# EasyEDA Pro project ProPrj_桌面数控电源New_2025-02-12.epro, schematic Schematic2
Board Name: FPC控制板; Create Date: 2025-02-01; Page Name: P1; Project Name: 桌面数控电源New; Schematic Name: Schematic2; Update Date: 2025-02-04; Company: 嘉立创EDA; Page Size: A4; Version: V1.0
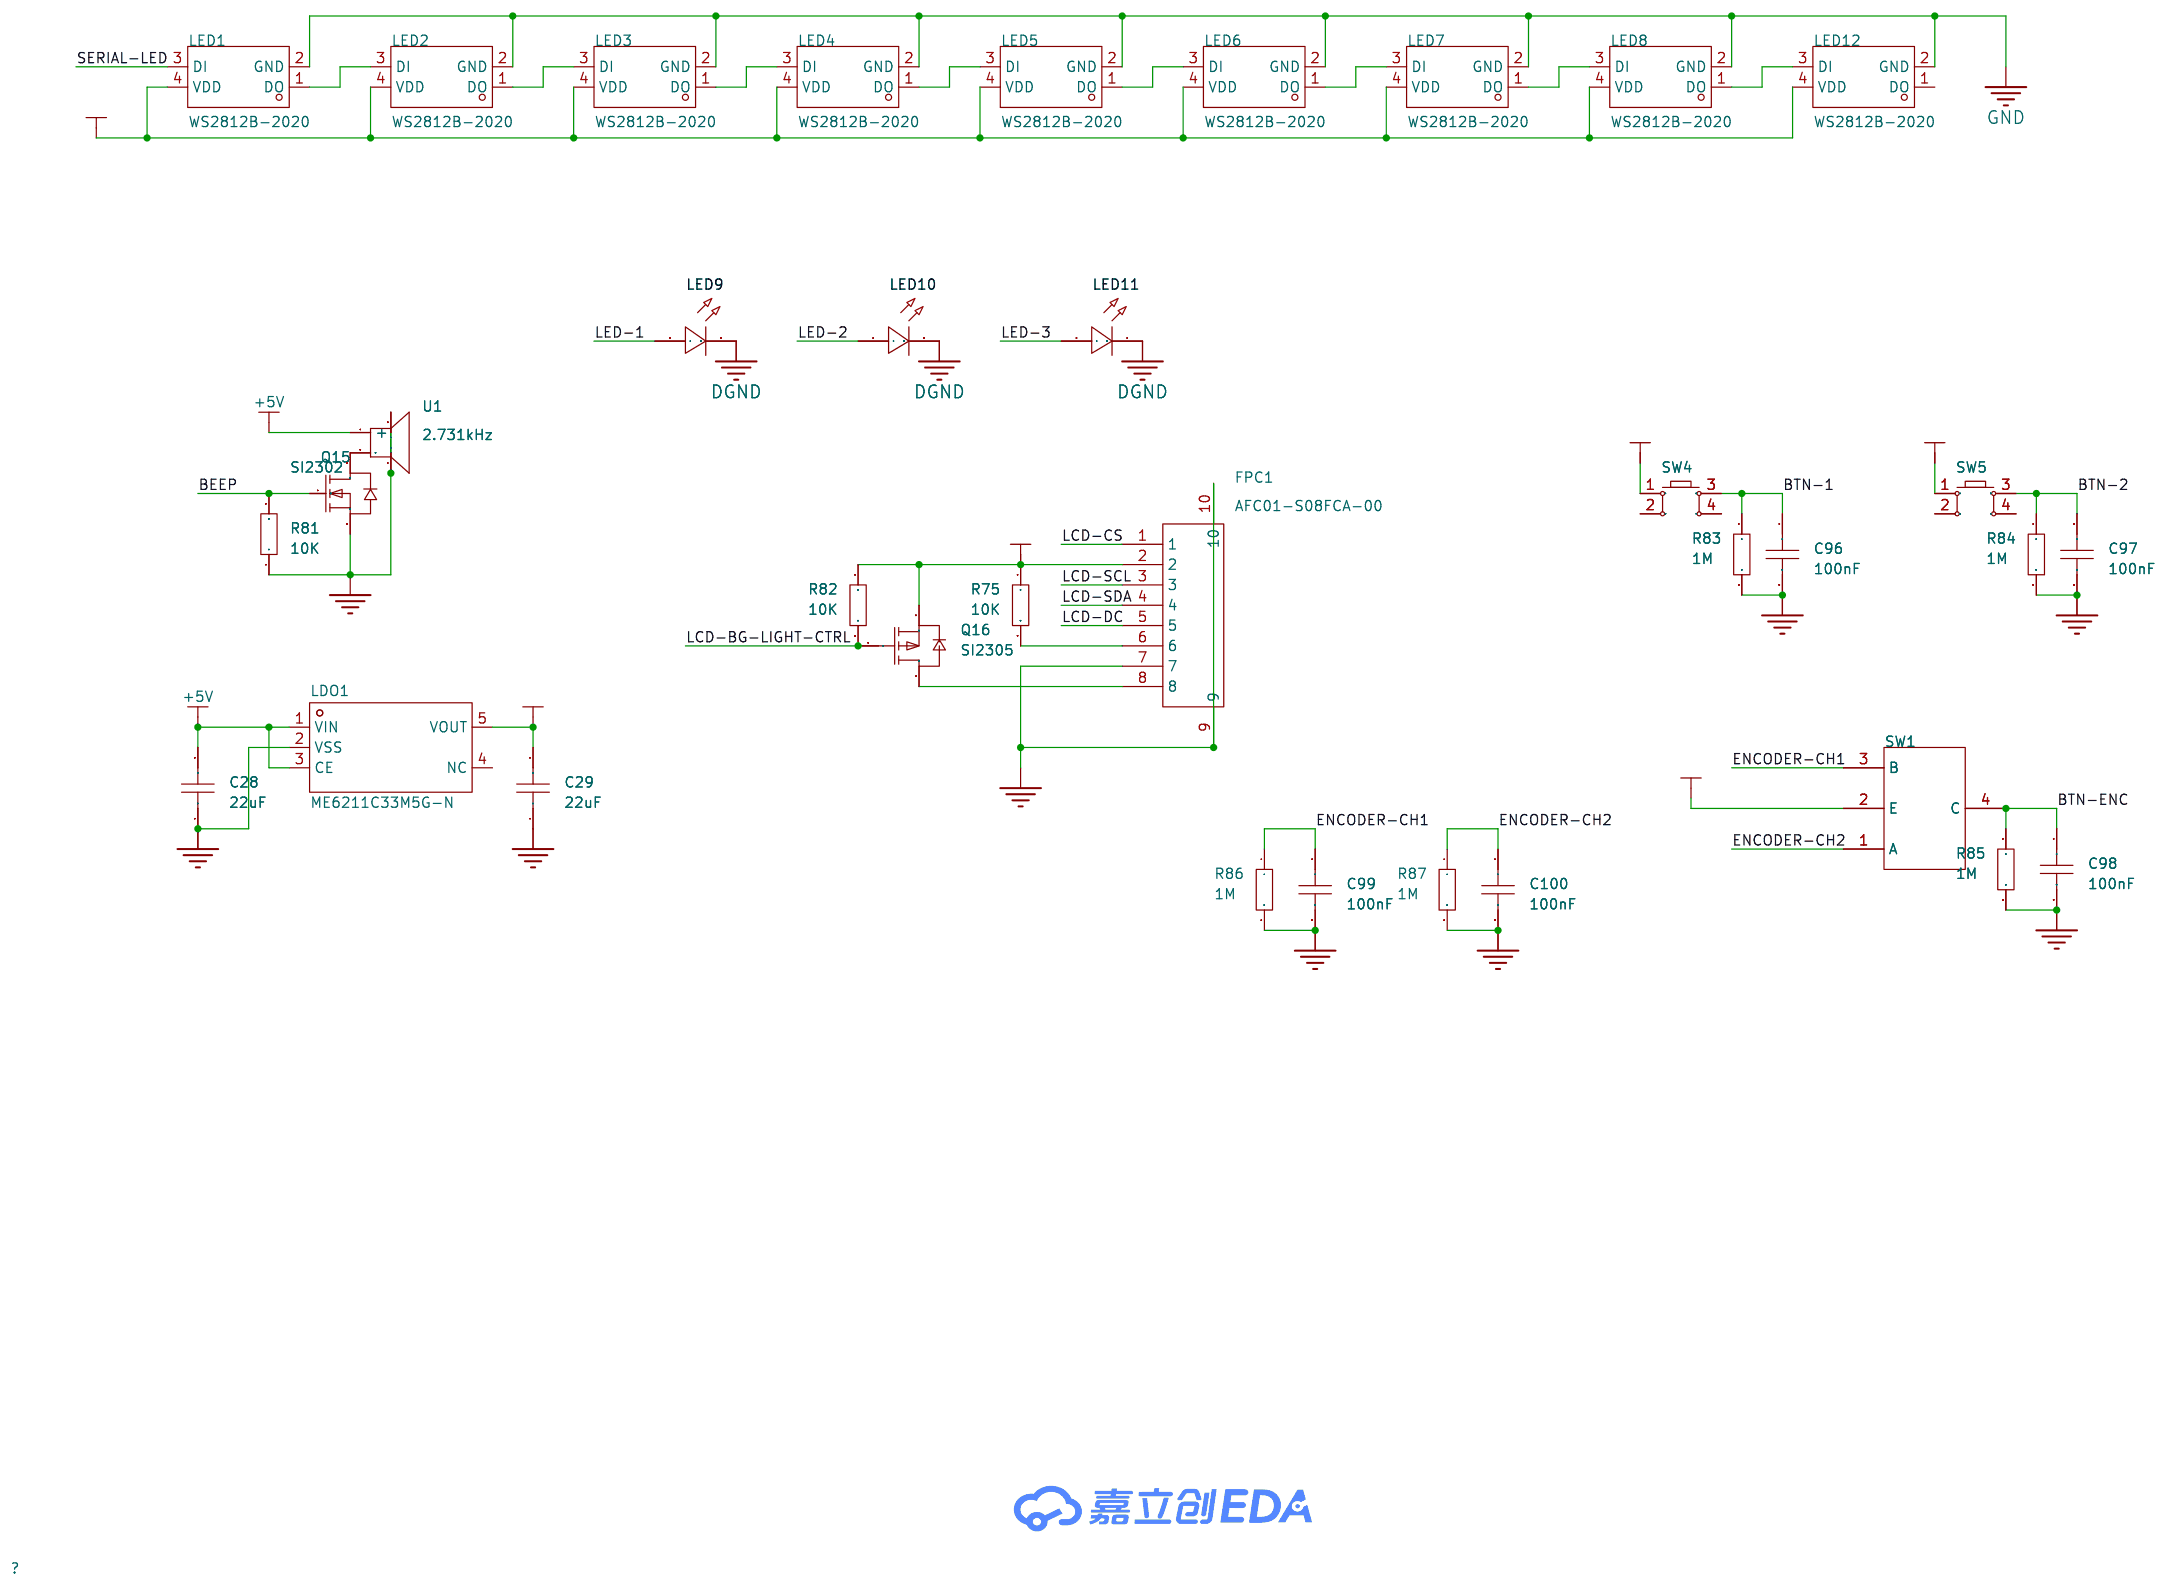
[diagram p1: schematic sheet]

## Parts
C28  22uF  [C0603]
C29  22uF  [C0603]
C96  100nF  [C0402]
C97  100nF  [C0402]
C98  100nF  [C0402]
C99  100nF  [C0402]
C100  100nF  [C0402]
FPC1  AFC01-S08FCA-00  [FPC-SMD_P0.50-8P_FGS-XJ-H2.0]
LDO1  ME6211C33M5G-N  [SOT-23-5_L3.0-W1.7-P0.95-LS2.8-BL]
LED1  WS2812B-2020  [LED-SMD_4P-L2.0-W2.0-TL_WS2812B-2020]
LED2  WS2812B-2020  [LED-SMD_4P-L2.0-W2.0-TL_WS2812B-2020]
LED3  WS2812B-2020  [LED-SMD_4P-L2.0-W2.0-TL_WS2812B-2020]
LED4  WS2812B-2020  [LED-SMD_4P-L2.0-W2.0-TL_WS2812B-2020]
LED5  WS2812B-2020  [LED-SMD_4P-L2.0-W2.0-TL_WS2812B-2020]
LED6  WS2812B-2020  [LED-SMD_4P-L2.0-W2.0-TL_WS2812B-2020]
LED7  WS2812B-2020  [LED-SMD_4P-L2.0-W2.0-TL_WS2812B-2020]
LED8  WS2812B-2020  [LED-SMD_4P-L2.0-W2.0-TL_WS2812B-2020]
LED9  -  [LED_0603]
LED10  -  [LED_0603]
LED11  -  [LED_0603]
LED12  WS2812B-2020  [LED-SMD_4P-L2.0-W2.0-TL_WS2812B-2020]
Q15  SI2302  [SOT-23-3_L2.9-W1.3-P1.90-LS2.4-BR]
Q16  SI2305  [SOT-23-3_L2.9-W1.3-P1.90-LS2.4-BR]
R75  10K  [R0402]
R81  10K  [R0402]
R82  10K  [R0402]
R83  1M  [R0402]
R84  1M  [R0402]
R85  1M  [R0402]
R86  1M  [R0402]
R87  1M  [R0402]
SW1  -  [EC06]
SW4  -  [Key_SMD_4.2x3.2x2.5]
SW5  -  [Key_SMD_4.2x3.2x2.5]
U1  2.731kHz  [BUZ-SMD_4P-L7.5-W7.5-BR]

## Library data of the parts
C28 C29 = CAP_0603: Supplier Footprint: 0603
C96-C100 = CAP_0402: Supplier Footprint: 0402
FPC1 = AFC01-S08FCA-00: 锁定特性:翻盖式;触点类型:下接;触点数量:8P;间距:0.5mm;安装类型:卧贴;; LCSC Part Name: 间距:0.5mm P数:8P 翻盖式 下接; Supplier Part: C262657; Manufacturer: JS(钜硕电子); Supplier Footprint: SMD,P=0.5mm,卧贴; JLCPCB Part Class: 扩展库; Datasheet: https://atta.szlcsc.com/upload/public/pdf/source/20190816/C413942_2A72D1AC756EAE17EEDF756A339D4500.pdf; Supplier: LCSC; Locking Feature: 翻盖式; Contact Type: 下接; Number of Contacts: 8P; Pitch: 0.5mm; Mounting Type: 卧贴; FFC, FCB Thickness: 0.3mm; Height Above Board: 2mm
LDO1 = ME6211C33M5G-N: 输出类型:固定;输出极性:正;最大输入电压:6V;输出电压:3.3V;输出电流:500mA;电源纹波抑制比(PSRR):70dB;; Supplier Part: C82942; Manufacturer: MICRONE(南京微盟); Supplier Footprint: SOT-23-5; Datasheet: https://atta.szlcsc.com/upload/public/pdf/source/20170918/C82942_1505727073070976520.pdf; Supplier: LCSC; Output Type: 固定; Output Polarity: 正; Number of Outputs: 1; Maximum Input Voltage: 6V; Output Voltage: 3.3V; Dropout Voltage: 260mV@(200mA); Output Current: 500mA; Power Supply Rejection Ratio (PSRR): 70dB
LED1-LED8 LED12 = WS2812B-2020: 12mA，小尺寸，高亮，用于小间距，小尺寸产品（注意防潮，请查阅规格书中对应具体内容）; LCSC Part Name: RGB三色; Supplier Part: C965555; Manufacturer: worldsemi; Supplier Footprint: SMD,2x2mm; JLCPCB Part Class: 扩展库; Datasheet: https://atta.szlcsc.com/upload/public/pdf/source/20241202/DEE3FC25B8AD87F3BB1718ACD77EDECD.pdf; Supplier: LCSC; Wavelength: 515.6nm；622.5nm；470.4nm
LED9-LED11 = LED_0603-G: Supplier Footprint: 0603
Q15 = SI2302: 类型:N沟道;漏源电压(Vdss):20V;连续漏极电流(Id):2.6A;功率(Pd):900mW;导通电阻(RDS(on)@Vgs,Id):85mΩ@4.5V,2.6A;阈值电压(Vgs(th)@Id):1.5V@250uA;栅极电荷(Qg@Vgs):-;输入电容(Ciss@Vds):880pF@6V;反向传输电容(Crss@Vds):-;工作温度:+150℃@(Tj);; LCSC Part Name: N沟道 20V 2.6A; Supplier Part: C2841377; Manufacturer: TECH PUBLIC(台舟); Supplier Footprint: SOT-23-3; JLCPCB Part Class: 扩展库; Datasheet: https://atta.szlcsc.com/upload/public/pdf/source/20210810/B45106B571BB908B9120BCB1C1283335.pdf; Supplier: LCSC; Type: N沟道; Drain Source Voltage (Vdss): 20V; Continuous Drain Current (Id): 2.6A; Power Dissipation (Pd): 900mW; Drain Source On Resistance (RDS(on)@Vgs,Id): 85mΩ@4.5V,2.6A; Gate Threshold Voltage (Vgs(th)@Id): 1.5V@250uA; Input Capacitance (Ciss@Vds): 880pF@6V; Operating Temperature: +150℃@(Tj)
Q16 = SI2305: 类型:1个P沟道;漏源电压(Vdss):12V;连续漏极电流(Id):4.1A;导通电阻(RDS(on)@Vgs,Id):65mΩ@2.5V,3A;功率(Pd):1.3W;阈值电压(Vgs(th)@Id):1V@250uA;; LCSC Part Name: 1个P沟道 耐压:12V 电流:4.1A; Supplier Part: C5248046; Manufacturer: GOODWORK(固得沃克); Supplier Footprint: SOT-23; JLCPCB Part Class: 扩展库; Datasheet: https://atta.szlcsc.com/upload/public/pdf/source/20221108/4BEB1330C0DF58195C97AD56AE793A1E.pdf; Supplier: LCSC; Type: 1个P沟道; Drain Source Voltage (Vdss): 12V; Continuous Drain Current (Id): 4.1A; Drain Source On Resistance (RDS(on)@Vgs,Id): 65mΩ@2.5V,3A; Power Dissipation (Pd): 1.3W; Gate Threshold Voltage (Vgs(th)@Id): 1V@250uA; Total Gate Charge (Qg@Vgs): 9nC; Input Capacitance (Ciss@Vds): 740pF@4V; Reverse Transfer Capacitance (Crss@Vds): 15pF; Operating Temperature: -50℃~+150℃
R75 R81-R87 = Res_0402: Supplier Footprint: 0402
SW1 = EC06: link: https://item.taobao.com/item.htm?spm=a1z0d.6639537.1997196601.4.5a807484iT5uYL&amp;id=617554748943
SW4 SW5 = Key_SMD_4.2x3.2x2.5: Supplier Footprint: SMD
U1 = HYG-7525A: 频率:2.731kHz;声压(SPL):85dB;; LCSC Part Name: 贴片无源蜂鸣器; Supplier Part: C7544812; Manufacturer: HYDZ(华宇); Supplier Footprint: SMD,7.5x7.5mm; JLCPCB Part Class: 扩展库; Datasheet: https://atta.szlcsc.com/upload/public/pdf/source/20230825/78098EC44B170663F3151CF5366FAD5D.pdf; Supplier: LCSC; Current Consumption: 90mA; Sound Pressure Level(SPL): 85dB

## Nets
+3.3V: C29.2 FPC1.2 LDO1.5(VOUT) LED1.4(VDD) LED2.4(VDD) LED3.4(VDD) LED4.4(VDD) LED5.4(VDD) LED6.4(VDD) LED7.4(VDD) LED8.4(VDD) LED12.4(VDD) Q16.2(S) R75.1 R82.1 SW1.2(E) SW4.1 SW5.1
+5V: C28.2 LDO1.1(VIN) LDO1.3(CE) U1.1(+)
DGND: LED9.1(C) LED10.1(C) LED11.1(C)
GND: C28.1 C29.1 C96.2 C97.2 C98.2 C99.2 C100.2 FPC1.7 FPC1.9 FPC1.10 LDO1.2(VSS) LED1.2(GND) LED2.2(GND) LED3.2(GND) LED4.2(GND) LED5.2(GND) LED6.2(GND) LED7.2(GND) LED8.2(GND) LED12.2(GND) Q15.2(S) R81.1 R83.2 R84.2 R85.2 R86.2 R87.2 U1.3 U1.4
BEEP: Q15.1(G) R81.2
BTN-1: C96.1 R83.1 SW4.3
BTN-2: C97.1 R84.1 SW5.3
BTN-ENC: C98.1 R85.1 SW1.4(C)
ENCODER-CH1: C99.1 R86.1 SW1.3(B)
ENCODER-CH2: C100.1 R87.1 SW1.1(A)
LCD-BG-LIGHT-CTRL: Q16.1(G) R82.2
LCD-CS: FPC1.1
LCD-DC: FPC1.5
LCD-SCL: FPC1.3
LCD-SDA: FPC1.4
LED-1: LED9.2(A)
LED-2: LED10.2(A)
LED-3: LED11.2(A)
SERIAL-LED: LED1.3(DI)
$1N713: LED1.1(DO) LED2.3(DI)
$1N719: LED2.1(DO) LED3.3(DI)
$1N726: LED3.1(DO) LED4.3(DI)
$1N733: LED4.1(DO) LED5.3(DI)
$1N740: LED5.1(DO) LED6.3(DI)
$1N747: LED6.1(DO) LED7.3(DI)
$1N754: LED7.1(DO) LED8.3(DI)
$1N1255: LED8.1(DO) LED12.3(DI)
$1N1431: Q15.3(D) U1.2
$1N1764: FPC1.8 Q16.3(D)
$1N1782: FPC1.6 R75.2

Not connected (* = marked no-connect by the designer): LDO1 4(NC); LED12 1(DO); SW4 2 4; SW5 2 4
